# EAGLE schematic LAMPS (EAGLE 6.3)
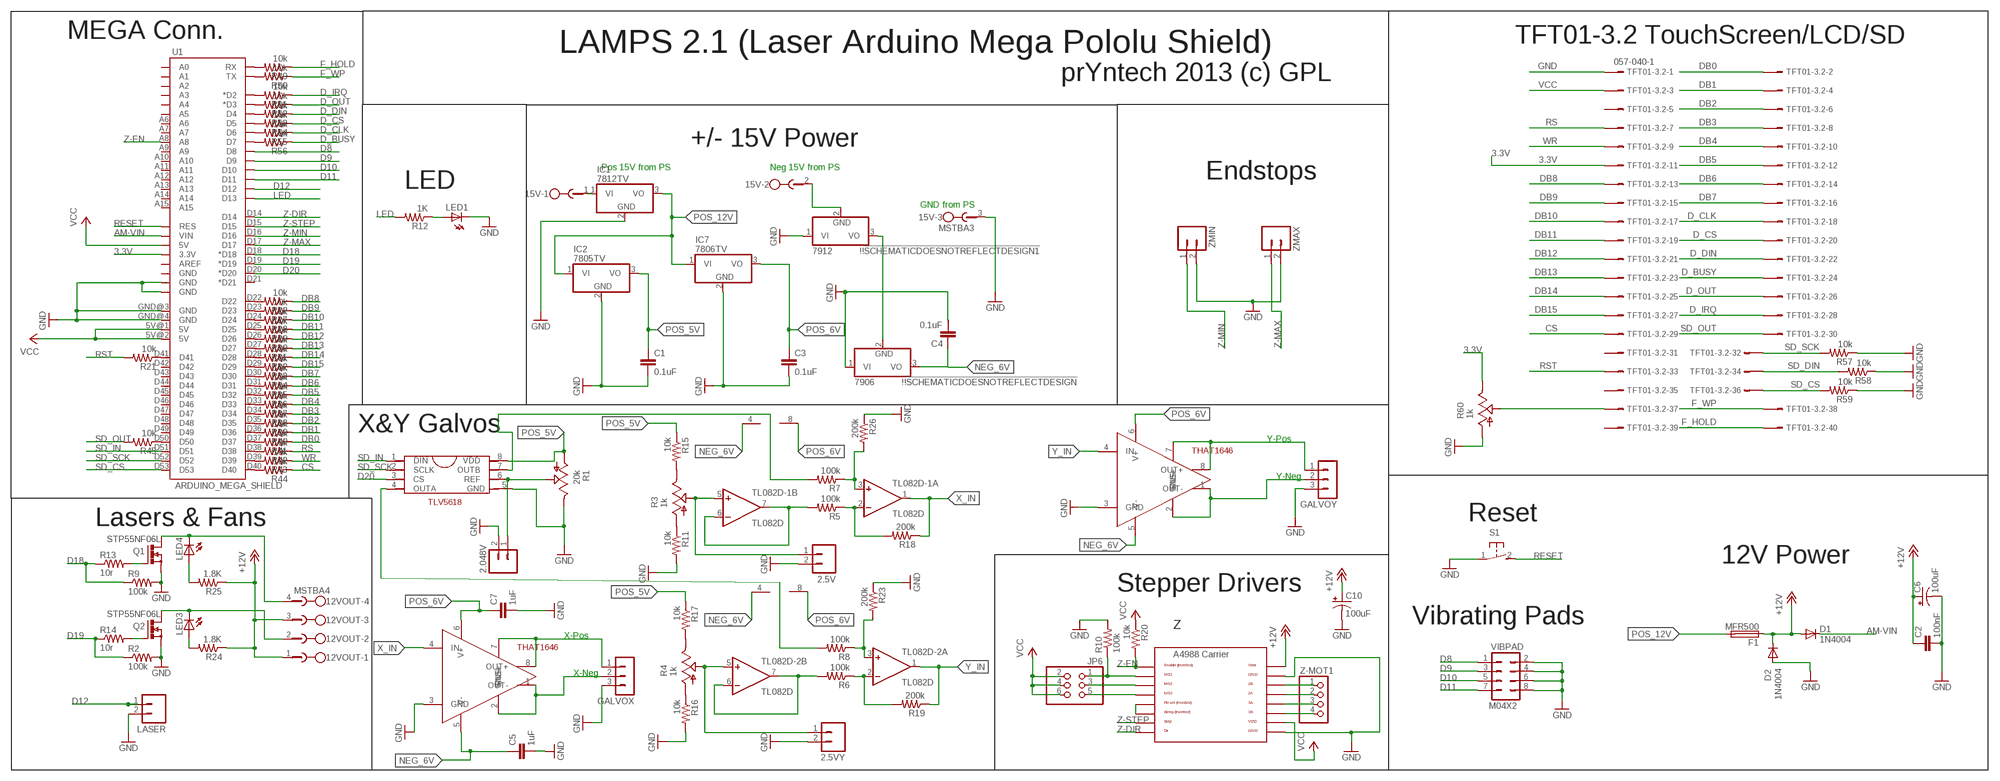
[diagram p0: schematic, sheet 1]

## Parts
2.5V  M02PTH  [1X02]
2.5VY  M02PTH  [1X02]
2.048V  M02PTH  [1X02]
12VOUT  MSTBA4  [MSTBA4]
15V  MSTBA3  [MSTBA3]
!!!SCHEMATICDOESNOTREFLECTDESIGN  7906  7805TV  [TO220V]
!!!SCHEMATICDOESNOTREFLECTDESIGN1  7912  7805TV  [TO220V]
C1  0.1uF  C2.5/2  [C2.5-2]
C2  100nF  C-EUC0805  [C0805]
C3  0.1uF  C2.5/2  [C2.5-2]
C4  0.1uF  C2.5/2  [C2.5-2]
C5  1uF  C2.5/2  [C2.5-2]
C6  100uF  CPOL-US153CLV-0605  [153CLV-0605]
C7  1uF  C2.5/2  [C2.5-2]
C10  100uF  CPOL-US153CLV-0605  [153CLV-0605]
D1  1N4004  [DO41-10]
D2  1N4004  [DO41-10]
F1  MFR500  PTCFUSE  [MFR500]
GALVOX  3PIN-HEADER  [3PIN-HEADER]
GALVOY  3PIN-HEADER  [3PIN-HEADER]
IC1  7812TV  [TO220V]
IC2  7805TV  [TO220V]
IC7  7806TV  7805TV  [TO220V]
JP6  PINHD-2X3  [2X03]
LASER  M02PTH  [1X02]
LED1  LEDCHIP-LED0805  [CHIP-LED0805]
LED3  LEDCHIP-LED0805  [CHIP-LED0805]
LED4  LEDCHIP-LED0805  [CHIP-LED0805]
Q1  STP55NF06L  IRF512  [TO220BV]
Q2  STP55NF06L  IRF512  [TO220BV]
R1  20k  TRIM_US-B25P  [B25P]
R2  100k  R-US_R0805  [R0805]
R3  1k  TRIM_US-B25P  [B25P]
R4  1k  TRIM_US-B25P  [B25P]
R5  100k  R-US_R0805  [R0805]
R6  100k  R-US_R0805  [R0805]
R7  100k  R-US_R0805  [R0805]
R8  100k  R-US_R0805  [R0805]
R9  100k  R-US_R0805  [R0805]
R10  100k  R-US_R0805  [R0805]
R11  10k  R-US_R0805  [R0805]
R12  1K  R-US_R0805  [R0805]
R13  10r  R-US_R0805  [R0805]
R14  10r  R-US_M0805  [M0805]
R15  10k  R-US_R0805  [R0805]
R16  10k  R-US_R0805  [R0805]
R17  10k  R-US_R0805  [R0805]
R18  200k  R-US_R0805  [R0805]
R19  200k  R-US_R0805  [R0805]
R20  10k  R-US_R0805  [R0805]
R21  10k  R-US_R0805  [R0805]
R22  10k  R-US_R0805  [R0805]
R23  200k  R-US_R0805  [R0805]
R24  1.8K  R-US_R0805  [R0805]
R25  1.8K  R-US_R0805  [R0805]
R26  200k  R-US_R0805  [R0805]
R27  10k  R-US_R0805  [R0805]
R28  10k  R-US_R0805  [R0805]
R29  10k  R-US_R0805  [R0805]
R30  10k  R-US_R0805  [R0805]
R31  10k  R-US_R0805  [R0805]
R32  10k  R-US_R0805  [R0805]
R33  10k  R-US_R0805  [R0805]
R34  10k  R-US_R0805  [R0805]
R35  10k  R-US_R0805  [R0805]
R36  10k  R-US_R0805  [R0805]
R37  10k  R-US_R0805  [R0805]
R38  10k  R-US_R0805  [R0805]
R39  10k  R-US_R0805  [R0805]
R40  10k  R-US_R0805  [R0805]
R41  10k  R-US_R0805  [R0805]
R42  10k  R-US_R0805  [R0805]
R43  10k  R-US_R0805  [R0805]
R44  10k  R-US_R0805  [R0805]
R45  10k  R-US_R0805  [R0805]
R49  10k  R-US_R0805  [R0805]
R50  10k  R-US_R0805  [R0805]
R51  10k  R-US_R0805  [R0805]
R52  10k  R-US_R0805  [R0805]
R53  10k  R-US_R0805  [R0805]
R54  10k  R-US_R0805  [R0805]
R55  10k  R-US_R0805  [R0805]
R56  10k  R-US_R0805  [R0805]
R57  10k  R-US_R0805  [R0805]
R58  10k  R-US_R0805  [R0805]
R59  10k  R-US_R0805  [R0805]
R60  1k  TRIM_US-B25P  [B25P]
S1  31-XX  [B3F-31XX]
TFT01-3.2  057-040-1  [057-040-1]
TL082D-1  TL082D  [SO08]
TL082D-2  TL082D  [SO08]
U1  ARDUINO_MEGA_SHIELD  [ARDUINO_MEGA_SHIELD]
U$1  THAT1646  [THAT1646]
U$2  THAT1646SMD  [TLV5618]
U$4  THAT1646  [THAT1646]
U$8  A4988BREAKOUT  [A4988BREAKOUT]
VIBPAD  M04X2  [2X4]
Z-MOT1  PINHD-1X4  [1X04]
ZMAX  M02PTH  [1X02]
ZMIN  M02PTH  [1X02]

## Nets
3.3V: R60.E TFT01-3.2.11 U1.3.3V
+12V [power]: 12VOUT.1 12VOUT.3 C2.1 C6.+ C10.+ D1.A D2.C F1.1 R24.1 R25.1 U$8.VMOT
AM-VIN [power]: D1.C U1.VIN
CS: R44.1 TFT01-3.2.29
D8: U1.D8 VIBPAD.1
D9: U1.D9 VIBPAD.3
D10: U1.D10 VIBPAD.5
D11: U1.D11 VIBPAD.7
D12: LASER.1 U1.D12
D18: R9.1 R13.1 U1.D18(*D18)
D19: R2.1 R14.1 U1.D19(*D19)
D20: U1.D20(*D20) U$2.3(CS)
D_BUSY: R56.1 TFT01-3.2.24
D_CLK: R55.1 TFT01-3.2.18
D_CS: R54.1 TFT01-3.2.20
D_DIN: R53.1 TFT01-3.2.22
D_IRQ: R51.1 TFT01-3.2.28
D_OUT: R52.1 TFT01-3.2.26
DB0: R41.1 TFT01-3.2.2
DB1: R40.1 TFT01-3.2.4
DB2: R39.1 TFT01-3.2.6
DB3: R38.1 TFT01-3.2.8
DB4: R37.1 TFT01-3.2.10
DB5: R36.1 TFT01-3.2.12
DB6: R35.1 TFT01-3.2.14
DB7: R34.1 TFT01-3.2.16
DB8: R22.1 TFT01-3.2.13
DB9: R27.1 TFT01-3.2.15
DB10: R28.1 TFT01-3.2.17
DB11: R29.1 TFT01-3.2.19
DB12: R30.1 TFT01-3.2.21
DB13: R31.1 TFT01-3.2.23
DB14: R32.1 TFT01-3.2.25
DB15: R33.1 TFT01-3.2.27
F_HOLD: R49.1 TFT01-3.2.40
F_WP: R50.1 TFT01-3.2.38
GND: 2.5V.2 2.5VY.2 2.048V.2 15V.3 !!!SCHEMATICDOESNOTREFLECTDESIGN1.1(VI) !!!SCHEMATICDOESNOTREFLECTDESIGN.1(VI) C1.2 C2.2 C3.2 C4.2 C5.2 C6.- C7.2 C10.- GALVOX.3 GALVOY.3 IC1.2(GND) IC2.2(GND) IC7.2(GND) LASER.2 LED1.C Q1.S Q2.S R1.E R2.2 R9.2 R10.2 R11.2 R16.2 R23.1 R26.1 R57.1 R58.1 R59.1 R60.A S1.1(P) TFT01-3.2.1 U1.GND@0(GND) U1.GND@1(GND) U1.GND@3(GND) U1.GND@4(GND) U$1.3(GND) U$2.5(GND) U$4.3(GND) U$8.GND U$8.GND@0(GND) VIBPAD.2 VIBPAD.4 VIBPAD.6 VIBPAD.8 ZMAX.2 ZMIN.2
GND_0: D2.A ; supply symbol labelled GND
LED: R12.2 U1.D13
N$1: 12VOUT.2 LED3.C Q2.D
N$2: R21.1 U1.D41
N$3: !!!SCHEMATICDOESNOTREFLECTDESIGN1.3(VO) !!!SCHEMATICDOESNOTREFLECTDESIGN.2(GND)
N$4: R4.A R16.1
N$5: R4.E R17.2
N$6: 2.048V.1 R1.S U$2.6(REF)
N$7: 12VOUT.4 LED4.C Q1.D
N$8: R3.A R11.1
N$9: R3.E R15.2
N$10: 2.5VY.1 R4.S TL082D-2.5(B:+IN)
N$11: 2.5V.1 R3.S TL082D-1.5(B:+IN)
N$12: GALVOX.2 U$1.1(OUT-) U$1.2(SNS-)
N$13: GALVOX.1 U$1.7(SNS+) U$1.8(OUT+)
N$14: R5.2 TL082D-1.6(B:-IN) TL082D-1.7(B:OUT)
N$15: R5.1 R18.2 TL082D-1.2(A:-IN)
N$16: R7.2 U$2.7(OUTB)
N$17: R7.1 R26.2 TL082D-1.3(A:+IN)
N$18: R6.2 TL082D-2.6(B:-IN) TL082D-2.7(B:OUT)
N$19: R22.2 U1.D22
N$20: R6.1 R19.2 TL082D-2.2(A:-IN)
N$21: R8.2 U$2.4(OUTA)
N$22: R8.1 R23.2 TL082D-2.3(A:+IN)
N$23: R27.2 U1.D23
N$24: GALVOY.2 U$4.1(OUT-) U$4.2(SNS-)
N$25: GALVOY.1 U$4.7(SNS+) U$4.8(OUT+)
N$26: R28.2 U1.D24
N$27: R29.2 U1.D25
N$28: R30.2 U1.D26
N$29: R31.2 U1.D27
N$30: R32.2 U1.D28
N$31: R33.2 U1.D29
N$32: R34.2 U1.D30
N$33: R35.2 U1.D31
N$34: R36.2 U1.D32
N$35: R37.2 U1.D33
N$36: R38.2 U1.D34
N$37: JP6.3 U$8.MS2
N$38: U$8.RST U$8.SLP(SLEEP)
N$39: JP6.5 U$8.MS3
N$40: JP6.1 R10.1 U$8.MS1
N$41: U$8.2B Z-MOT1.1
N$42: U$8.2A Z-MOT1.2
N$43: U$8.1A Z-MOT1.3
N$44: U$8.1B Z-MOT1.4
N$45: LED3.A R24.2
N$46: LED1.A R12.1
N$47: Q2.G R14.2
N$48: Q1.G R13.2
N$49: R39.2 U1.D35
N$50: LED4.A R25.2
N$51: R40.2 U1.D36
N$52: R41.2 U1.D37
N$53: R42.2 U1.D38
N$54: R43.2 U1.D39
N$55: R44.2 U1.D40
N$56: R45.1 U1.D50
N$58: 15V.1 IC1.1(VI)
N$59: 15V.2 !!!SCHEMATICDOESNOTREFLECTDESIGN1.2(GND)
N$60: R49.2 U1.RX
N$61: R50.2 U1.TX
N$62: R51.2 U1.D2(*D2)
N$63: R52.2 U1.D3(*D3)
N$64: R53.2 U1.D4
N$65: R54.2 U1.D5
N$66: R55.2 U1.D6
N$67: R56.2 U1.D7
N$86: R60.S TFT01-3.2.37
NEG_6V: !!!SCHEMATICDOESNOTREFLECTDESIGN.3(VO) C4.1 C5.1 TL082D-1.4(P:V-) TL082D-2.4(P:V-) U$1.5(V-)
POS_5V: C1.1 IC2.3(VO) R1.A R15.1 R17.1 U$2.8(VDD)
POS_6V: C3.1 C7.1 IC7.3(VO) TL082D-1.8(P:V+) TL082D-2.8(P:V+) U$1.6(V+) U$4.6(V+)
POS_12V [power]: F1.2 IC1.3(VO) IC2.1(VI) IC7.1(VI)
RESET: S1.2(S) U1.RES
RS: R42.1 TFT01-3.2.7
RST: R21.2 TFT01-3.2.33
SD_CS: R59.2 TFT01-3.2.36 U1.D53
SD_DIN: R58.2 TFT01-3.2.34
SD_IN: U1.D51 U$2.1(DIN)
SD_OUT: R45.2 TFT01-3.2.30
SD_SCK: R57.2 TFT01-3.2.32 U1.D52 U$2.2(SCLK)
T2_5: U$4.5(V-)
VCC: JP6.2 JP6.4 JP6.6 R20.1 TFT01-3.2.3 U1.5V@0(5V) U1.5V@1(5V) U1.5V@2(5V) U$8.VDD
WR: R43.1 TFT01-3.2.9
X_IN: R18.1 TL082D-1.1(A:OUT) U$1.4(IN)
Y_IN: R19.1 TL082D-2.1(A:OUT) U$4.4(IN)
Z-DIR: U1.D14 U$8.DIR
Z-EN: R20.2 U1.A8 U$8.EN
Z-MAX: U1.D17 ZMAX.1
Z-MIN: U1.D16 ZMIN.1
Z-STEP: U1.D15 U$8.STEP
Unconnected: TFT01-3.2.5 TFT01-3.2.31 TFT01-3.2.35 TFT01-3.2.39 U1.A0 U1.A1 U1.A2 U1.A3 U1.A4 U1.A5 U1.A6 U1.A7 U1.A9 U1.A10 U1.A11 U1.A12 U1.A13 U1.A14 U1.A15 U1.AREF U1.D21(*D21) U1.D42 U1.D43 U1.D44 U1.D45 U1.D46 U1.D47 U1.D48 U1.D49 U1.GND@2(GND)

## Notes on the sheet
- MEGA Conn. | TFT01-3.2 TouchScreen/LCD/SD
- LAMPS 2.1 (Laser Arduino Mega Pololu Shield)
- prYntech 2013 (c) GPL
- +/- 15V Power
- Pos 15V from PS | Neg 15V from PS
- Endstops
- LED
- GND from PS
- X&Y Galvos
- Y-Pos
- Y-Neg
- Lasers & Fans | Reset
- 12V Power
- Stepper Drivers
- Vibrating Pads
- Z
- X-Pos
- X-Neg

## Library data of the parts
2.5V 2.5VY 2.048V LASER ZMAX ZMIN = SparkFun:M02: Header 2 Standard 2-pin 0.1" header. Use with straight break away headers (SKU : PRT-00116), right angle break away headers (PRT-00553), swiss pins (PRT-00743), machine pins (PRT-00117), and female headers (PRT-00115). Molex polarized connector foot print use with SKU : PRT-08233 with associated crimp pins and housings.; OC_NEWARK: unknown
12VOUT = con-phoenix-508:MSTBA4: PHOENIX; OC_FARNELL: 3705195; OC_NEWARK: unknown
15V = con-phoenix-508:MSTBA3: PHOENIX; MF: FARNELL; MPN: 1757255; OC_FARNELL: 3705183; OC_NEWARK: 71C4162
!!!SCHEMATICDOESNOTREFLECTDESIGN !!!SCHEMATICDOESNOTREFLECTDESIGN1 = linear:78*: Positive VOLTAGE REGULATOR Source: http://cache.national.com/ds/LM/LM78L05.pdf http://www.fairchildsemi.com/ds/LM/LM7805.pdf; MPN: KA7906TU; OC_NEWARK: 94M7930
C1 C3-C5 C7 = capacitor-wima:C: CAPACITOR naming: grid - package width; OC_NEWARK: unknown
C2 = resistor:C-EU: CAPACITOR, European symbol; OC_NEWARK: unknown
C6 C10 = adafruit:CPOL-US: POLARIZED CAPACITOR, American symbol; OC_NEWARK: unknown
D1 D2 = diode:1N4004: DIODE general purpose rectifier, 1 A; OC_NEWARK: unknown
F1 = RepRapjr:PTCFUSE: LITTLEFUSE Picofuse/slow Littlefuse; OC_NEWARK: unknown
GALVOX GALVOY = ultimachine:3PIN-HEADER: PIN HEADER; OC_NEWARK: unknown
IC1 IC2 IC7 = linear:78*: Positive VOLTAGE REGULATOR Source: http://cache.national.com/ds/LM/LM78L05.pdf http://www.fairchildsemi.com/ds/LM/LM7805.pdf; OC_NEWARK: unknown
JP6 = pinhead:PINHD-2X3: PIN HEADER; OC_NEWARK: unknown
LED1 LED3 LED4 = led:LED: LED OSRAM: - CHIPLED LG R971, LG N971, LY N971, LG Q971, LY Q971, LO R971, LY R971 LH N974, LH R974 LS Q976, LO Q976, LY Q976 LO Q996 - Hyper CHIPLED LW Q18S LB Q993, LB Q99A, LB R99A - SideLED LS A670, LO A670, LY A670, LG A670, LP A670 LB A673, LV A673, LT A673, LW A673 LH A674 LY A675 LS A676, LA A676, LO A676, LY A676, LW A676 LS A679, LY A679, LG A679 - Hyper Micro SIDELED? LS Y876, LA Y876, LO Y876, LY Y876 LT Y87S - SmartLED LW L88C, LW L88S LB L89C, LB L89S, LG L890 LS L89K, LO L89K, LY L89K LS L896, LA L896, LO L896, LY L896 - TOPLED LS T670, LO T670, LY T670, LG T670, LP T670 LSG T670, LSP T670, LSY T670, LOP T670, LYG T670 LG T671, LOG T671, LSG T671 LB T673, LV T673, LT T673, LW T673 LH T674 LS T676, LA T676, LO T676, LY T676, LB T676, LH T676, LSB T676, LW T676 LB T67C, LV T67C, LT T67C, LS T67K, LO T67K, LY T67K, LW E67C LS E67B, LA E67B, LO E67B, LY E67B, LB E67C, LV E67C, LT E67C LW T67C LS T679, LY T679, LG T679 LS T770, LO T770, LY T770, LG T770, LP T770 LB T773, LV T773, LT T773, LW T773 LH T774 LS E675, LA E675, LY E675, LS T675 LS T776, LA T776, LO T776, LY T776, LB T776 LHGB T686 LT T68C, LB T68C - Hyper Mini TOPLED? LB M676 - Mini TOPLED Santana? LG M470 LS M47K, LO M47K, LY M47K Source: http://www.osram.convergy.de LUXEON: - LUMILED? LXK2-PW12-R00, LXK2-PW12-S00, LXK2-PW14-U00, LXK2-PW14-V00 LXK2-PM12-R00, LXK2-PM12-S00, LXK2-PM14-U00 LXK2-PE12-Q00, LXK2-PE12-R00, LXK2-PE12-S00, LXK2-PE14-T00, LXK2-PE14-U00 LXK2-PB12-K00, LXK2-PB12-L00, LXK2-PB12-M00, LXK2-PB14-N00, LXK2-PB14-P00, LXK2-PB14-Q00 LXK2-PR12-L00, LXK2-PR12-M00, LXK2-PR14-Q00, LXK2-PR14-R00 LXK2-PD12-Q00, LXK2-PD12-R00, LXK2-PD12-S00 LXK2-PH12-R00, LXK2-PH12-S00 LXK2-PL12-P00, LXK2-PL12-Q00, LXK2-PL12-R00 Source: www.luxeon.com KINGBRIGHT: KA-3528ASYC Source: www.kingbright.com; OC_NEWARK: unknown
Q1 Q2 = transistor-power:IRF512: N-CHANNEL MOS FET; MF: INTERNATIONAL RECTIFIER(IR); MPN: IRF1010EZPBF; OC_NEWARK: 63J7168
R1 R3 R4 R60 = pot:TRIM_US-: POTENTIOMETER; OC_NEWARK: unknown
R2 R5-R12 R15-R45 R49-R59 = adafruit:R-US_: RESISTOR, American symbol; OC_NEWARK: unknown
R13 R14 = resistor:R-US_: RESISTOR, American symbol; OC_NEWARK: unknown
S1 = switch-omron:31-XX: OMRON SWITCH; OC_FARNELL: 959704; OC_NEWARK: unknown
TFT01-3.2 = con-panduit:057-040-: CONNECTOR 40-pin series 057 contact pc board low profile headers; OC_FARNELL: unknown; OC_NEWARK: unknown
TL082D-1 TL082D-2 = linear:TL082: OP AMP; OC_NEWARK: unknown
U1 = RepRapjr:ARDUINO_MEGA_SHIELD; OC_NEWARK: unknown
U$1 U$4 = THAT1646:THAT1646: THAT 1646 Balanced Line Driver (DIP) Datasheet: http://www.thatcorp.com/datashts/THAT_1606-1646_Datasheet.pdf; MPN: THAT1646P08-U; OC_NEWARK: 50M5186
U$2 = TLV5618:THAT1646: TLV 5618 12 BIT DAC Datasheet: http://www.mouser.com/ds/2/405/slas230h-117520.pdf
U$8 = RepRapjr:A4988BREAKOUT; OC_NEWARK: unknown
VIBPAD = SparkFun:M04X2; OC_NEWARK: unknown
Z-MOT1 = RepRapjr:PINHD-1X4: PIN HEADER; OC_NEWARK: unknown

## Net classes
1 power: width 1.016 mm